# Altium schematic sheet 咸味勺子-20210715.SchDoc
size A4
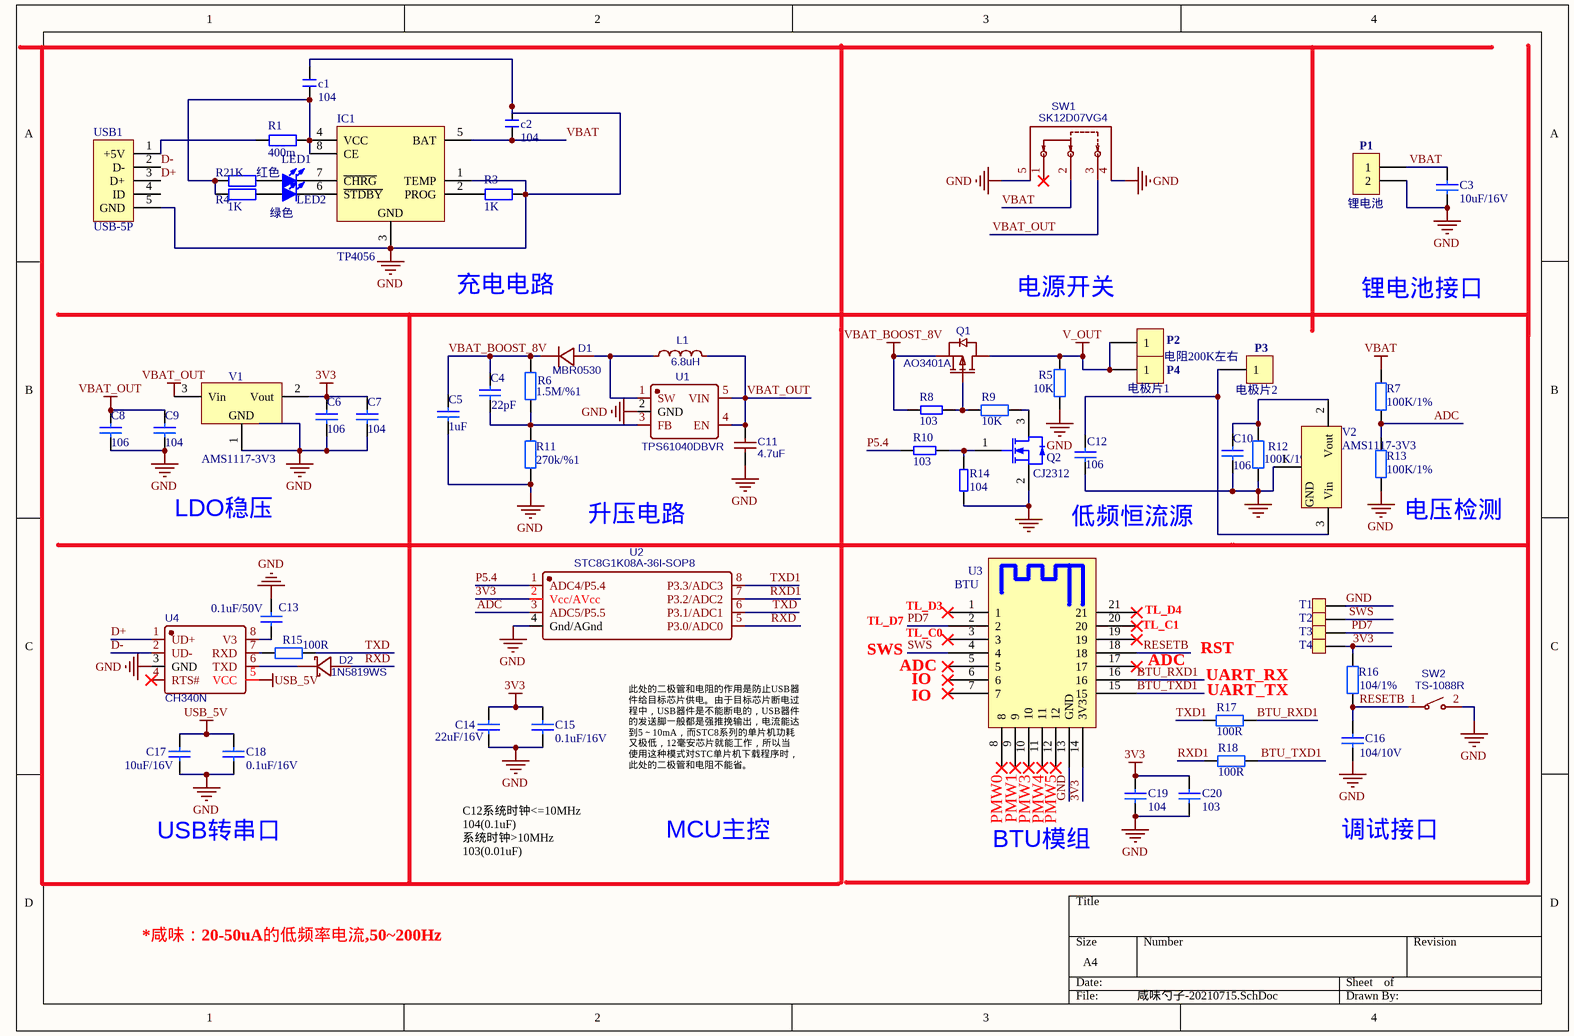
[diagram p0: 咸味勺子-20210715.SchDoc]

## Parts
c1  104  [C 0805_M]
c2  104  [C 0805_M]
C3  10uF/16V  [C0603]
C4  22pF  [C0402_GRM15]
C5  1uF  [C0603]
C6  106  [C0603]
C7  104  [C0402_GRM15]
C8  106  [C0603]
C9  104  [C0402_GRM15]
C10  106  [C0603]
C11  4.7uF  [JMK212BJ475KG-T]
C12  106  [C0603]
C13  0.1uF/50V  [C0402_GRM15]
C14  22uF/16V  [C0603]
C15  0.1uF/16V  [C0402_GRM15]
C16  104/10V  [C0402_GRM15]
C17  10uF/16V  [C0603]
C18  0.1uF/16V  [C0402_GRM15]
C19  104  [C0402_GRM15]
C20  103  [C0402_GRM15]
D1  MBR0530  [MBR0530]
D2  1N5819WS  [1N5819WS]
IC1  TP4056  [SOP8_M]
L1  6.8uH  [CDRH3D23NP-6R8PC]
LED1  红色  [LED 0805B]
LED2  绿色  [LED 0805B]
P1  锂电池  [1.5mm 2p接插件]
P2  CON1  [焊点1]  (value not drawn)
P3  CON1  [焊点1]  (value not drawn)
P4  CON1  [焊点1]  (value not drawn)
Q1  AO3401A  [AO3401A]
Q2  CJ2312  [CJ2312]
R1  400m  [R 1210_M]
R2  1K  [R 0805_M]
R3  1K  [R 0805_M]
R4  1K  [R 0805_M]
R5  10K  [R0402]
R6  1.5M/%1  [R0402]
R7  100K/1%  [R0402]
R8  103  [R0402]
R9  10K  [R0402]
R10  103  [R0402]
R11  270k/%1  [R0402]
R12  100K/1%  [R0402]
R13  100K/1%  [R0402]
R14  104  [R0402]
R15  100R  [R0402]
R16  104/1%  [R0402]
R17  100R  [R0402]
R18  100R  [R0402]
SW1  SK12D07VG4  [SK12D07VG4]
SW2  TS-1088R  [TS-1088R-02026]
T1  TP  [TP1]  (value not drawn)
T2  TP  [TP1]  (value not drawn)
T3  TP  [TP1]  (value not drawn)
T4  TP  [TP1]  (value not drawn)
U1  TPS61040DBVR  [TPS61040DBVR]
U2  STC8G1K08A-36I-SOP8  [STC8G1K08A-36I-SOP8]
U3  BTU  [CBU1]
U4  CH340N  [CH340N]
USB1  USB-5P  [USB-MICRO_A]
V1  AMS1117-3V3  [SOT89_M]
V2  AMS1117-3V3  [SOT89_M]

## Nets
3V3: C6.1 C7.1 C14.2 C15.2 C19.1 C20.1 R16.2 T4.1 U2.2(Vcc/AVcc) U3.14(3V3) V1.2(Vout)
GND: c1.2 c2.2 C3.2 C5.2 C6.2 C7.2 C8.2 C9.2 C10.2 C11.1 C12.2 C13.2 C14.1 C15.1 C16.2 C17.1 C18.1 C19.2 C20.2 IC1.1(TEMP) IC1.3(GND) P1.2 Q2.2(S) R3.2 R5.2 R11.1 R12.1 R13.1 R14.1 SW1.4 SW1.5 SW2.2 T1.1 U1.2(GND) U2.4(Gnd/AGnd) U3.13(GND) U4.3(GND) USB1.5(GND) V1.1(GND) V2.1(GND)
USB_5V: C17.2 C18.2 U4.5(VCC)
V_OUT: P2.1 P4.1 Q1.3(D) R5.1
VBAT: c2.1 C3.1 IC1.5(BAT) P1.1 R7.2 SW1.2
VBAT_BOOST_8V: C4.1 C5.1 D1.1(K) Q1.2(S) R6.2 R8.1
VBAT_OUT: C8.1 C9.1 C11.2 L1.2 SW1.3 U1.4(EN) U1.5(VIN) V1.3(Vin)
ADC: R7.1 R13.2 U2.3(ADC5/P5.5)
BTU_RXD1: R17.1 U3.16
BTU_TXD1: R18.1 U3.15
D+: U4.1(UD+) USB1.3(D+)
D-: U4.2(UD-) USB1.2(D-)
P5.4: R10.1 U2.1(ADC4/P5.4)
PD7: T3.1 U3.2
RESETB: C16.1 R16.1 SW2.1 U3.18
RXD: D2.2(A) U2.5(P3.0/ADC0)
RXD1: R18.2 U2.7(P3.2/ADC2)
SWS: T2.1 U3.4
TXD: R15.2 U2.6(P3.1/ADC1)
TXD1: R17.2 U2.8(P3.3/ADC3)
Netc1_1: c1.1 IC1.4(VCC) IC1.8(CE) R1.2 R2.1 R4.1
NetC4_2: C4.2 R6.1 R11.2 U1.3(FB)
NetC10_1: C10.1 R12.2 V2.2(Vout)
NetC12_1: C12.1 P3.1 V2.3(Vin)
NetC13_1: C13.1 U4.8(V3)
NetD1_2: D1.2(A) L1.1 U1.1(SW)
NetD2_1: D2.1(C) U4.6(TXD)
NetIC1_2: IC1.2(PROG) R3.1
NetIC1_6: IC1.6(~{STDBY}) LED2.2(K)
NetIC1_7: IC1.7(~{CHRG}) LED1.2(K)
NetLED1_1: LED1.1(A) R2.2
NetLED2_1: LED2.1(A) R4.2
NetQ1_1: Q1.1(G) R8.2 R9.1
NetQ2_1: Q2.1(G) R10.2 R14.2
NetQ2_3: Q2.3(D) R9.2
NetR1_1: R1.1 USB1.1(+5V)
NetR15_1: R15.1 U4.7(RXD)

Not connected (* = marked no-connect by the designer): SW1 1*; U3 1* 3* 5* 6* 7* 8* 9* 10* 11* 12* 17* 19* 20* 21*; U4 4(RTS#)*; USB1 4(ID)

## Notes on the sheet
- 充电电路
- 电源开关
- 锂电池接口
- 电阻200K左右
- (near P4) 电极片1
- (near P3) 电极片2
- LDO稳压
- (near R13) 电压检测
- 升压电路
- 低频恒流源
- SWS
- TL_D7
- (near U3) TL_D3
- (near U3) TL_C0
- (near U3) TL_C1
- (near U3) TL_D4
- RST
- ADC
- IO
- (near R17) UART_RX
- (near R17) UART_TX
- USB转串口
- C12系统时钟<=10MHz
  104(0.1uF)
  系统时钟>10MHz
  103(0.01uF)
- 此处的二极管和电阻的作用是防止USB器件给目标芯片供电。由于目标芯片断电过程中，USB器件是不能断电的，USB器件的发送脚一般都是强推挽输出，电流能达到5～10mA，而STC8系列的单片机功耗又极低，12毫安芯片就能工作，所以当使用这种模式对STC单片机下载程序时，此处的二极管和电阻不能省。
- MCU主控
- BTU模组
- PMW0
- PMW1
- PMW3
- PMW4
- PMW5
- 调试接口
- *咸味：20-50uA的低频率电流,50~200Hz

## Library data of the parts
c1 c2 = 0805: 学习资源: www.ooocke.com
C3-C10 C12 C16 C19 C20 = 1.02.05.00869: 无极性电容; Part Number: 1.02.05.00869
C11 = 4.7uF: BOM_Manufacturer: TAIYO YUDEN; nameAlias: Capacitance; BOM_Supplier: LCSC; BOM_Manufacturer Part: JMK212BJ475KG-T; BOM_Supplier Part: C92788; spicePre: C; spiceSymbolName: JMK212BJ475KG-T
C13 = 1.02.05.00834: 无极性电容; 物料通用性等级: 高; 工作温度: null; 物料描述: 瓷介电容;贴片;X7R;0.1UF;±10%;50V;0603; 制造商: 华科; 制造商型号: 0603B104K500CT; Orcad Library: C; Orcad Library Path: Z:\tuya_lib\sch-lib\DISCRETE.OLB; Orcad Footprint: c0603,c0603a; Orcad Footprint Path: Z:\tuya_lib\footprint; 管脚数量: 2; 安装方式: 贴片; 物料类目: 瓷介电容; 物料状态: 已发布; 修改人: system; 物料生产状态: 量产; Part Number: 1.02.05.00834; Value: 0.1uF/50V; ComponentLink2Description: null; ComponentLink2URL: null; 器件高度: null; 更新时间: 2021-03-25 10:51:02; ALT_SYMBOLS: c0603,c0603a
C14 C17 = 1.02.03.00181: 无极性电容; Value: 1uF/16V; 物料通用性等级: 高; 工作温度: null; 物料描述: 瓷介电容;贴片;X7R;1UF;±10%;16V;0603; 制造商: 三星(SAMSUNG); 制造商型号: CL10B105KO8NNNC; Orcad Library: #N/A; 管脚数量: 2; 安装方式: 贴片; 物料类目: 瓷介电容; 物料状态: 已发布; 修改人: system; 物料生产状态: 量产; Part Number: 1.02.03.00181; ComponentLink2Description: 三星MLCC.pdf; ComponentLink2URL: file:///\\172.16.246.8\lib-ad\DBlib\Datasheet\电容类资料\三星MLCC.pdf; Orcad Library Path: #N/A; Orcad Footprint: #N/A; Orcad Footprint Path: #N/A; 器件高度: null; 更新时间: 2021-03-25 10:51:02; ALT_SYMBOLS: #N/A
C15 C18 = 1.02.05.00834: 无极性电容; Value: 0.1uF/50V; 物料通用性等级: 高; 工作温度: null; 物料描述: 瓷介电容;贴片;X7R;0.1UF;±10%;50V;0603; 制造商: 华科; 制造商型号: 0603B104K500CT; Orcad Library: C; Orcad Library Path: Z:\tuya_lib\sch-lib\DISCRETE.OLB; Orcad Footprint: c0603,c0603a; Orcad Footprint Path: Z:\tuya_lib\footprint; 管脚数量: 2; 安装方式: 贴片; 物料类目: 瓷介电容; 物料状态: 已发布; 修改人: system; 物料生产状态: 量产; Part Number: 1.02.05.00834; ComponentLink2Description: null; ComponentLink2URL: null; 器件高度: null; 更新时间: 2021-03-25 10:51:02; ALT_SYMBOLS: c0603,c0603a
D1 = MBR0530_C475718: BOM_Manufacturer: Shikues; Contributor: LCSC; BOM_Supplier: LCSC; BOM_Supplier Part: C475718; BOM_Manufacturer Part: MBR0530; BOM_JLCPCB Part Class: Extended Part; spicePre: D; spiceSymbolName: MBR0530_C475718
D2 = 1N5819WS_C1884554: BOM_Manufacturer: YFW佑风微; Contributor: LCSC; BOM_Supplier: LCSC; BOM_Supplier Part: C1884554; BOM_Manufacturer Part: 1N5819WS; BOM_JLCPCB Part Class: Extended Part; spicePre: D; spiceSymbolName: 1N5819WS_C1884554
L1 = 6.8uH: BOM_Manufacturer: Sumida; nameAlias: Inductance; Contributor: LCSC; BOM_Supplier: LCSC; BOM_Supplier Part: C323532; BOM_Manufacturer Part: CDRH3D23NP-6R8PC; spicePre: L; spiceSymbolName: CDRH3D23NP-6R8PC
LED1 LED2 = LED-SMD: 贴片LED; BOM名称: 贴片LED; 学习资源: www.ooocke.com
P1 = CON2: Connector
Q1 = AO3401A_C700954: BOM_Manufacturer: HUASHUO(华朔); Contributor: LCSC; BOM_Supplier: LCSC; BOM_Supplier Part: C700954; BOM_Manufacturer Part: AO3401A; BOM_JLCPCB Part Class: Extended Part; spicePre: Q; spiceSymbolName: AO3401A_C700954
Q2 = 1.06.11.00008: N-Channel MOSFET; 物料通用性等级: 高; 工作温度: null; 物料描述: 场效应管;N沟道;CJ2312;20V;5A;31.8MR/4.5V;SOT-23;贴片; 制造商: 江苏长电; Orcad Library: FETN_GSD; Orcad Library Path: ‪Z:\tuya_lib\sch-lib\DISCRETE.OLB; Orcad Footprint: sot23-3; Orcad Footprint Path: Z:\tuya_lib\footprint; 管脚数量: 3; 器件高度: 1.15mm; 安装方式: 贴片; 物料类目: 场效应管; 物料状态: 已发布; 修改人: system; 物料生产状态: 量产; Part Number: 1.06.11.00008; Value: CJ2312; ComponentLink2Description: CJ2312.pdf; ComponentLink2URL: file:///\\172.16.246.8\lib-ad\DBlib\Datasheet\三极管资料\CJ2312.pdf; 制造商型号: CJ2312; 更新时间: 2021-03-25 10:51:02
R1 = 1812: 贴片电阻; BOM名称: 贴片电阻; 学习资源: www.ooocke.com
R2-R4 = 0805-1: 贴片电阻; BOM名称: 贴片电阻; 学习资源: www.ooocke.com
R5-R7 R9 R11-R13 = 100K/1%: 电阻; Value: 100K/1%
R8 R10 R14 = RES-1: RES
R15 = 1.01.01.00808: 电阻; Value: 200R; 物料通用性等级: 中; 工作温度: null; 物料描述: 普通电阻;200R;±5%;0603;1/10W;贴片;; 制造商: 厚声(UniOhm); 制造商型号: 0603WAJ0201***; Orcad Library: R; Orcad Library Path: Z:\tuya_lib\sch-lib\DISCRETE.OLB; Orcad Footprint: r0603; Orcad Footprint Path: Z:\tuya_lib\footprint; 管脚数量: 2; 安装方式: 贴片; 物料类目: 普通电阻; 物料状态: 已发布; 修改人: system; 物料生产状态: 量产; Part Number: 1.01.01.00808; ComponentLink2Description: 厚生电阻规格书.pdf; ComponentLink2URL: file:///\\172.16.246.8\lib-ad\DBlib\Datasheet\电阻类\厚生电阻规格书.pdf; 器件高度: null; 更新时间: 2021-03-25 10:51:02; ALT_SYMBOLS: r0603
R16-R18 = 1.01.01.00808: 电阻; Part Number: 1.01.01.00808
SW1 = SK12D07VG4: BOM_Manufacturer: SHOU HAN; Contributor: LCSC; BOM_Supplier: LCSC; BOM_Supplier Part: C393937; BOM_Manufacturer Part: SK12D07VG4; BOM_JLCPCB Part Class: Extended Part; spicePre: S; spiceSymbolName: SK12D07VG4
SW2 = TS-1088R-02026: BOM_Manufacturer: XUNPU; Contributor: LCSC; BOM_Paste Type: expand; BOM_Supplier: LCSC; BOM_Supplier Part: C455280; BOM_Manufacturer Part: TS-1088R-02026; spicePre: S; spiceSymbolName: TS-1088R-02026
U1 = TPS61040DBVR: BOM_Manufacturer: TI; BOM_Supplier: LCSC; BOM_Manufacturer Part: TPS61040DBVR; BOM_Supplier Part: C7722; BOM_JLCPCB Part Class: Basic Part; spicePre: U; spiceSymbolName: TPS61040DBVR
U2 = STC8G1K08A-36I-SOP8: BOM_Manufacturer: STC Micro; Contributor: LCSC; BOM_Supplier: LCSC; BOM_Supplier Part: C915663; BOM_Manufacturer Part: STC8G1K08A-36I-SOP8; BOM_JLCPCB Part Class: Extended Part; spicePre: U; spiceSymbolName: STC8G1K08A-36I-SOP8
U3 = CBU: Part Number: 0110; 制造商: 涂鸦; Process: 贴片; Value: CBU; Component Type: Standard; 描述: CBU; 制造商型号: CBU; Pin Count: 21
U4 = CH340N: BOM_Manufacturer: WCH(Jiangsu Qin Heng); Contributor: LCSC; BOM_Paste Type: expand; BOM_Supplier: LCSC; BOM_Supplier Part: C506813; BOM_Manufacturer Part: CH340N; spicePre: U; spiceSymbolName: CH340N
USB1 = USB-5P: 微型USB母座; BOM名称: 微型USB母座; 学习资源: www.ooocke.com
V1 V2 = AMS1117: 学习资源: www.ooocke.com
IC1 = TP4056: 学习资源: www.ooocke.com